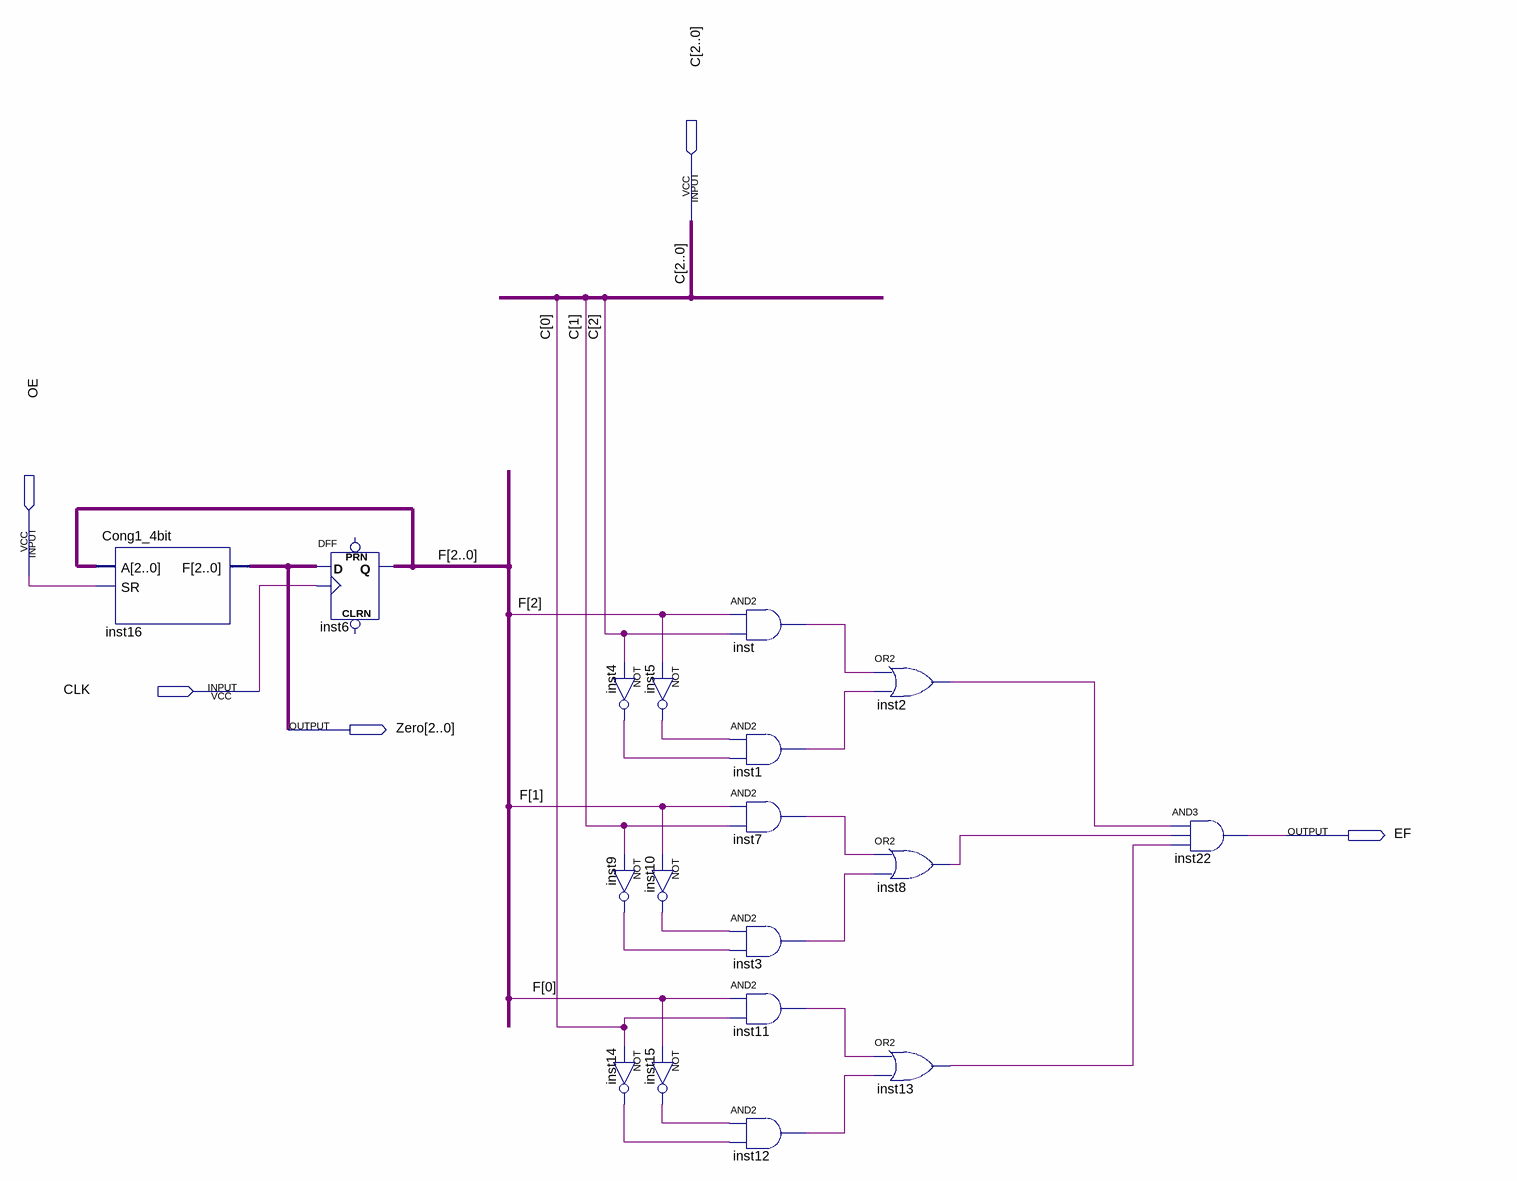
[diagram p0: schematic sheet]
// Quartus schematic CMPADD.bdf as structural Verilog: 18 symbols, 5 pins
module CMPADD (
  input  [2:0] C,
  input  OE,
  input  CLK,
  output [2:0] Zero,
  output EF
);

  wire inst1_out, inst2_out, inst3_out, inst4_out, inst5_out, inst7_out, inst8_out, inst9_out, inst10_out,
       inst11_out, inst12_out, inst13_out, inst14_out, inst15_out, inst_out;
  wire [2:0] F;

  Cong1_4bit inst16 (.A(F), .SR(OE), .F(Zero));
  DFF inst6[2:0] (.CLK(CLK), .D(Zero), .Q(F));  // open: CLRN, PRN
  not inst4 (inst4_out, C[2]);
  not inst5 (inst5_out, F[2]);
  not inst9 (inst9_out, C[1]);
  not inst10 (inst10_out, F[1]);
  not inst14 (inst14_out, C[0]);
  not inst15 (inst15_out, F[0]);
  and inst (inst_out, F[2], C[2]);
  and inst1 (inst1_out, inst5_out, inst4_out);
  and inst7 (inst7_out, F[1], C[1]);
  and inst3 (inst3_out, inst10_out, inst9_out);
  and inst11 (inst11_out, F[0], C[0]);
  and inst12 (inst12_out, inst15_out, inst14_out);
  or inst2 (inst2_out, inst_out, inst1_out);
  or inst8 (inst8_out, inst7_out, inst3_out);
  or inst13 (inst13_out, inst11_out, inst12_out);
  and inst22 (EF, inst2_out, inst8_out, inst13_out);
endmodule
